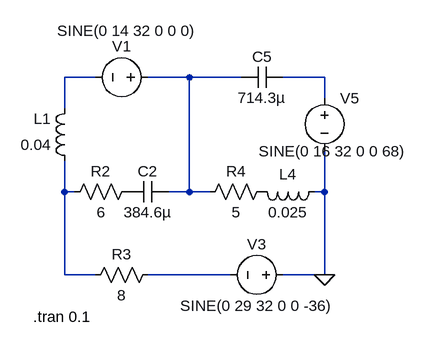
[diagram p0: schematic рр4.asc]
рр4.asc, the LTspice schematic file:
Version 4
SHEET 1 1128 680
WIRE 112 64 64 64
WIRE 256 64 192 64
WIRE 336 64 256 64
WIRE 464 64 400 64
WIRE 464 96 464 64
WIRE 64 112 64 64
WIRE 64 240 64 192
WIRE 80 240 64 240
WIRE 256 240 256 64
WIRE 256 240 224 240
WIRE 288 240 256 240
WIRE 464 240 464 176
WIRE 464 240 448 240
WIRE 64 368 64 240
WIRE 112 368 64 368
WIRE 320 368 192 368
WIRE 464 368 464 240
WIRE 464 368 400 368
FLAG 464 368 0
SYMBOL voltage 208 64 R90
WINDOW 0 -32 56 VBottom 2
WINDOW 3 -87 48 VTop 2
WINDOW 123 0 0 Left 0
WINDOW 39 0 0 Left 0
SYMATTR InstName V1
SYMATTR Value SINE(0 14 32 0 0 0)
SYMBOL cap 400 48 R90
WINDOW 0 0 32 VBottom 2
WINDOW 3 32 32 VTop 2
SYMATTR InstName C5
SYMATTR Value 714.3µ
SYMBOL voltage 464 80 R0
WINDOW 123 0 0 Left 0
WINDOW 39 0 0 Left 0
WINDOW 3 -101 98 Left 2
SYMATTR InstName V5
SYMATTR Value SINE(0 16 32 0 0 68)
SYMBOL ind 464 224 R90
WINDOW 0 5 56 VBottom 2
WINDOW 3 32 56 VTop 2
SYMATTR InstName L4
SYMATTR Value 0.025
SYMBOL res 384 224 R90
WINDOW 0 0 56 VBottom 2
WINDOW 3 32 56 VTop 2
SYMATTR InstName R4
SYMATTR Value 5
SYMBOL cap 160 256 R270
WINDOW 0 32 32 VTop 2
WINDOW 3 0 32 VBottom 2
SYMATTR InstName C2
SYMATTR Value 384.6µ
SYMBOL res 64 256 R270
WINDOW 0 32 56 VTop 2
WINDOW 3 0 56 VBottom 2
SYMATTR InstName R2
SYMATTR Value 6
SYMBOL ind 80 208 R180
WINDOW 0 36 80 Left 2
WINDOW 3 36 40 Left 2
SYMATTR InstName L1
SYMATTR Value 0.04
SYMBOL res 208 352 R90
WINDOW 0 0 56 VBottom 2
WINDOW 3 32 56 VTop 2
SYMATTR InstName R3
SYMATTR Value 8
SYMBOL voltage 416 368 R90
WINDOW 0 -32 56 VBottom 2
WINDOW 3 32 56 VTop 2
WINDOW 123 0 0 Left 0
WINDOW 39 0 0 Left 0
SYMATTR InstName V3
SYMATTR Value SINE(0 29 32 0 0 -36)
TEXT 16 432 Left 2 !.tran 0.1

The netlist it stands for:
* рр4.asc
V1 N002 N001 SINE(0 14 32 0 0 0)
C5 N003 N002 714.3µ
V5 N003 0 SINE(0 16 32 0 0 68)
L4 0 P001 0.025
R4 P001 N002 5
C2 P002 N002 384.6µ
R2 N004 P002 6
L1 N004 N001 0.04
R3 N005 N004 8
V3 0 N005 SINE(0 29 32 0 0 -36)
.tran 0.1
.backanno
.end